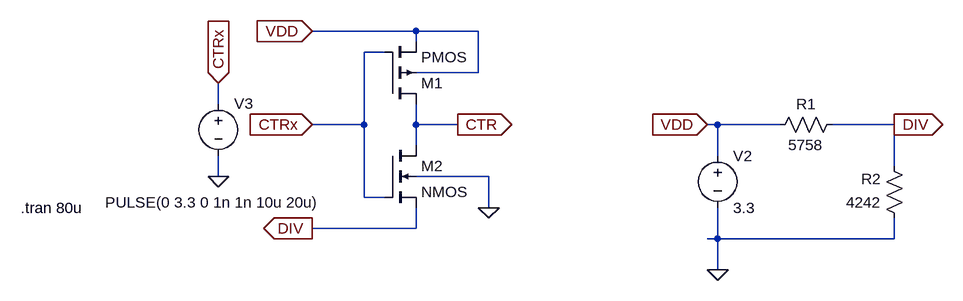
[diagram p0: schematic RDR com divisor.asc]
RDR com divisor.asc, the LTspice schematic file:
Version 4
SHEET 1 1124 680
WIRE -864 -576 -1024 -576
WIRE -768 -576 -864 -576
WIRE -864 -560 -864 -576
WIRE -912 -544 -944 -544
WIRE -768 -512 -768 -576
WIRE -768 -512 -864 -512
WIRE -1168 -464 -1168 -496
WIRE -944 -432 -944 -544
WIRE -944 -432 -1024 -432
WIRE -864 -432 -864 -464
WIRE -800 -432 -864 -432
WIRE -400 -432 -416 -432
WIRE -304 -432 -400 -432
WIRE -128 -432 -224 -432
WIRE -864 -400 -864 -432
WIRE -400 -384 -400 -432
WIRE -128 -368 -128 -432
WIRE -1168 -352 -1168 -384
WIRE -752 -352 -864 -352
WIRE -944 -320 -944 -432
WIRE -912 -320 -944 -320
WIRE -752 -304 -752 -352
WIRE -864 -272 -864 -304
WIRE -864 -272 -1024 -272
WIRE -400 -256 -400 -304
WIRE -400 -256 -416 -256
WIRE -128 -256 -128 -288
WIRE -128 -256 -400 -256
WIRE -400 -208 -400 -256
FLAG -752 -304 0
FLAG -800 -432 CTR
IOPIN -800 -432 Out
FLAG -1024 -576 VDD
IOPIN -1024 -576 In
FLAG -1024 -432 CTRx
IOPIN -1024 -432 In
FLAG -1024 -272 DIV
IOPIN -1024 -272 Out
FLAG -1168 -352 0
FLAG -1168 -496 CTRx
IOPIN -1168 -496 In
FLAG -128 -432 DIV
IOPIN -128 -432 Out
FLAG -400 -208 0
FLAG -416 -432 VDD
IOPIN -416 -432 In
SYMBOL pmos4 -912 -464 M180
SYMATTR InstName M1
SYMBOL nmos4 -912 -400 R0
SYMATTR InstName M2
SYMBOL voltage -1168 -480 R0
WINDOW 123 0 0 Left 2
WINDOW 39 0 0 Left 2
WINDOW 3 -174 168 Left 2
SYMATTR Value PULSE(0 3.3 0 1n 1n 10u 20u)
SYMATTR InstName V3
SYMBOL res -208 -448 R90
WINDOW 0 0 56 VBottom 2
WINDOW 3 32 56 VTop 2
SYMATTR InstName R1
SYMATTR Value 5758
SYMBOL res -112 -272 R180
WINDOW 0 36 76 Left 2
WINDOW 3 36 40 Left 2
SYMATTR InstName R2
SYMATTR Value 4242
SYMBOL voltage -400 -400 R0
SYMATTR InstName V2
SYMATTR Value 3.3
TEXT -1472 -304 Left 2 !.tran 80u

The netlist it stands for:
* RDR com divisor.asc
M1 CTR CTRx VDD VDD PMOS
M2 CTR CTRx DIV 0 NMOS
V3 CTRx 0 PULSE(0 3.3 0 1n 1n 10u 20u)
R1 DIV VDD 5758
R2 0 DIV 4242
V2 VDD 0 3.3
.model NMOS NMOS
.model PMOS PMOS
.lib standard.mos
.tran 80u
.backanno
.end